# Altium schematic sheet 3_p2_power.schdoc
size 307 x 218 mm; Symbol: Sheet-Symbol_A4; Device: Sheet-Symbol_A4; @Project Name: ai_camera; @Page Count: 5; @Update Date: 2026-03-19; @Create Date: 2026-03-11; @Schematic Name: Schematic1; @Page No: 3; @Page Name: p2_power; @Board Name: Board1; Company: 嘉立创EDA; Version: V1.0; Page Size: A4; Convert to PCB: yes; Add into BOM: yes; Title Block Position: 3; Width: 1170; Height: 825; Region Start: 1; X Region Count: 6; Y Region Count: 4; Blade Width: 10; @Create Time: 00:25:12; @Update Time: 15:53:27
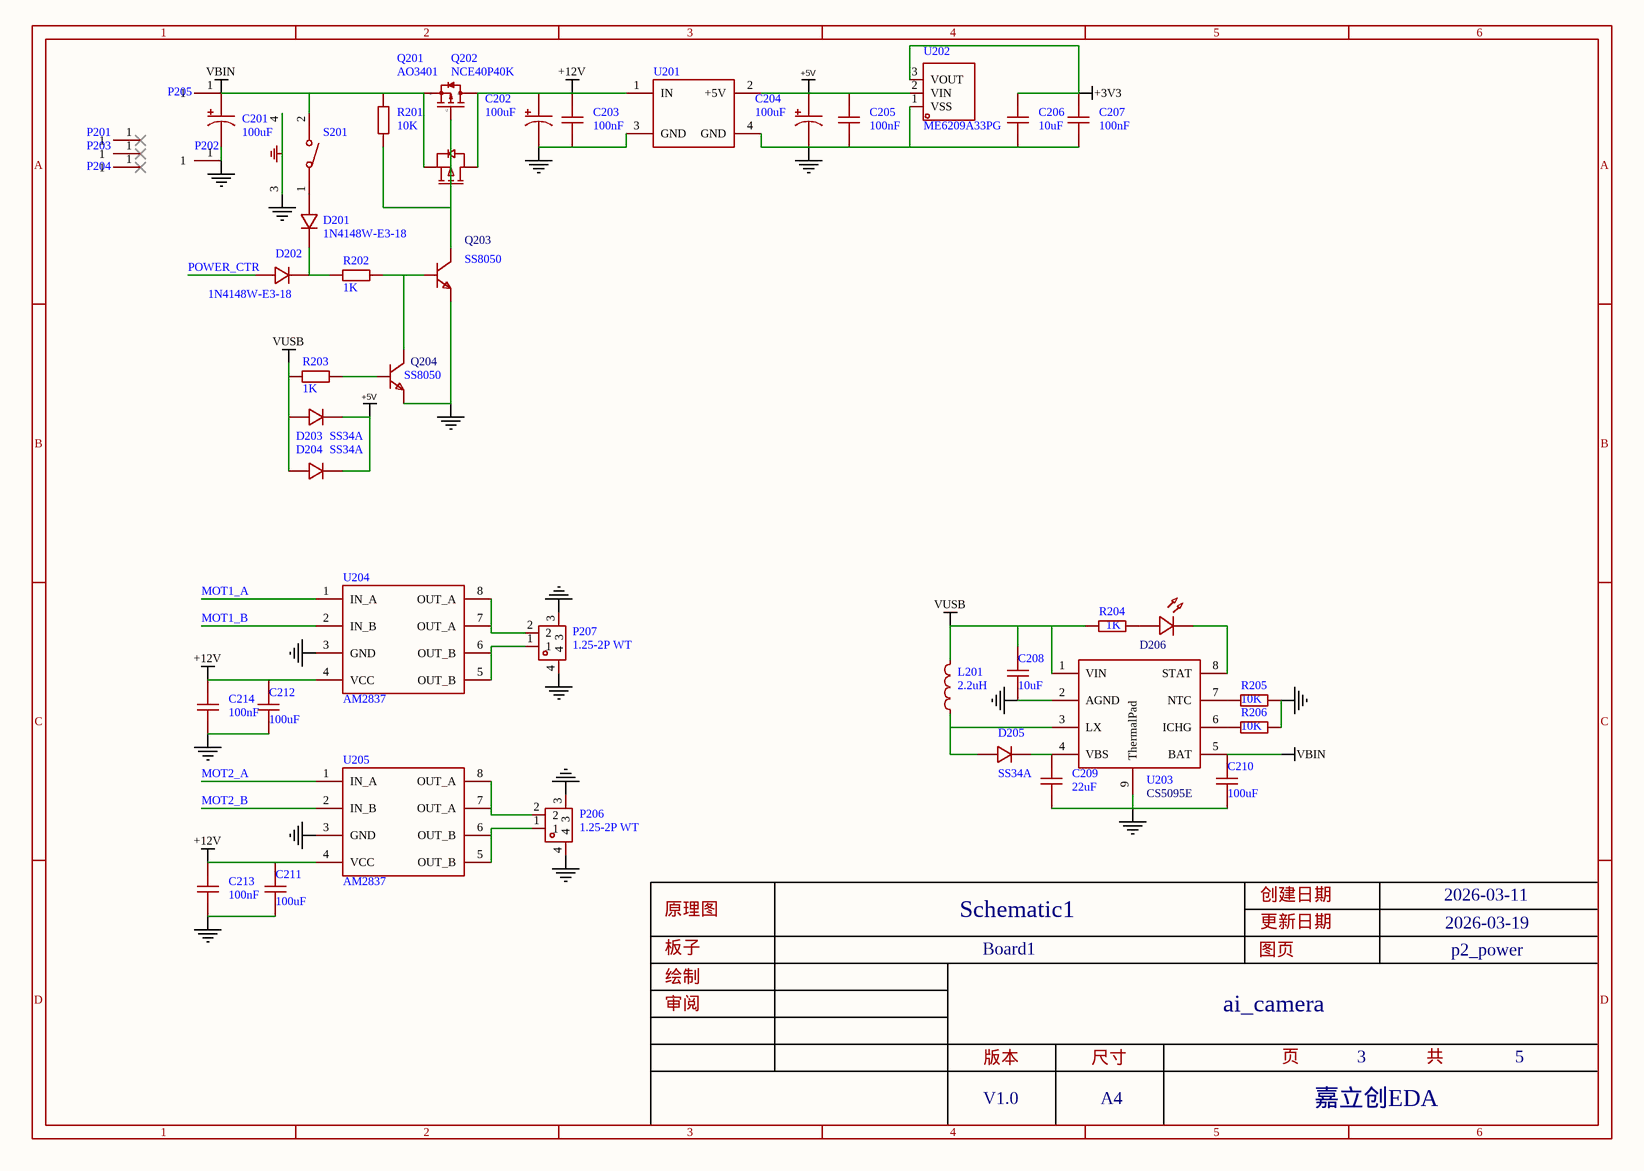
[diagram p0: 3_p2_power.schdoc]

## Parts
C201  100uF  [CAP-SMD_BD6.3-L6.6-W6.6-LS7.2-R-RD]
C202  100uF  [CAP-SMD_BD6.3-L6.6-W6.6-LS7.2-R-RD]
C203  100nF  [C0603]
C204  100uF  [CAP-SMD_BD6.3-L6.6-W6.6-LS7.2-R-RD]
C205  100nF  [C0603]
C206  10uF  [C0603]
C207  100nF  [C0603]
C208  10uF  [C0805]
C209  22uF  [C0805]
C210  100uF  [C0805]
C211  100uF  [C0805]
C212  100uF  [C0805]
C213  100nF  [C0603]
C214  100nF  [C0603]
D201  1N4148W-E3-18  [SOD-123_L2.7-W1.6-LS3.7-FD]
D202  1N4148W-E3-18  [SOD-123_L2.7-W1.6-LS3.7-FD]
D203  SS34A  [SMA_L4.3-W2.6-LS5.2-RD]
D204  SS34A  [SMA_L4.3-W2.6-LS5.2-RD]
D205  SS34A  [SMA_L4.3-W2.6-LS5.2-RD]
D206  (no value)  [LED_0603]
L201  2.2uH  [IND-SMD_L5.8-W5.2]
P201  (no value)  [Single_Pin]
P202  (no value)  [Single_Pin]
P203  (no value)  [Single_Pin]
P204  (no value)  [Single_Pin]
P205  (no value)  [Single_Pin]
P206  1.25-2P WT  [CONN-SMD_1.25-2PWT]
P207  1.25-2P WT  [CONN-SMD_1.25-2PWT]
Q201  AO3401  [SOT-23-3_L2.9-W1.3-P1.90-LS2.4-BR]
Q202  NCE40P40K  [TO-252-2_L6.6-W6.1-P4.57-LS9.9-TL-CW]
Q203  SS8050  [SOT-23-3_L2.9-W1.3-P1.90-LS2.4-BR]
Q204  SS8050  [SOT-23-3_L2.9-W1.3-P1.90-LS2.4-BR]
R201  10K  [R0603]
R202  1K  [R0603]
R203  1K  [R0603]
R204  1K  [R0603]
R205  10K  [R0603]
R206  10K  [R0603]
S201  TC-1102N-C-A-B  [SW-TH_TC-1102N-C-A-B]  (value not drawn)
U201  (no value)  [CX8823_MO]
U202  ME6209A33PG  [SOT-89-3_L4.5-W2.5-P1.50-LS4.2-BR]
U203  (no value)  [ESOP-8_L4.9-W3.9-P1.27-LS6.0-BL-EP]
U204  AM2837  [sop-8_l5.0-w4.0-p1.27-ls6.2-bl]
U205  AM2837  [sop-8_l5.0-w4.0-p1.27-ls6.2-bl]

## Nets
+3V3: C206.2 C207.2 U202.3(VOUT)
+5V: C204.1 C205.2 D203.1(C) D204.1(C) U201.2(+5V) U202.2(VIN)
+12V: C202.1 C203.2 C211.1 C212.1 C213.2 C214.2 Q201.3(D) Q202.2(D) U201.1(IN) U204.4(VCC) U205.4(VCC)
GND: C201.2 C202.2 C203.1 C204.2 C205.1 C206.1 C207.1 C208.2 C209.2 C210.2 C211.2 C212.2 C213.1 C214.1 P202.1 P206.3 P206.4 P207.3 P207.4 Q203.2(E) Q204.2(E) R205.1 R206.1 S201.3 S201.4 U201.3(GND) U201.4(GND) U202.1(VSS) U203.2(AGND) U203.9(ThermalPad) U204.3(GND) U205.3(GND)
VBIN: C201.1 C210.1 P205.1 Q201.2(S) Q202.3(S) R201.2 S201.2 U203.5(BAT)
VUSB: C208.1 D203.2(A) D204.2(A) L201.2 R203.2 R204.2 U203.1(VIN)
MOT1_A: U204.1(IN_A)
MOT1_B: U204.2(IN_B)
MOT2_A: U205.1(IN_A)
MOT2_B: U205.2(IN_B)
POWER_CTR: D202.1(A)
NetC209_1: C209.1 D205.1(C) U203.4(VBS)
NetD201_1: D201.1(A) S201.1
NetD201_2: D201.2(K) D202.2(K) R202.2
NetD205_2: D205.2(A) L201.1 U203.3(LX)
NetD206_1: D206.1(C) U203.8(STAT)
NetD206_2: D206.2(A) R204.1
NetP206_1: P206.1 U205.5(OUT_B) U205.6(OUT_B)
NetP206_2: P206.2 U205.7(OUT_A) U205.8(OUT_A)
NetP207_1: P207.1 U204.5(OUT_B) U204.6(OUT_B)
NetP207_2: P207.2 U204.7(OUT_A) U204.8(OUT_A)
NetQ201_1: Q201.1(G) Q202.1(G) Q203.3(C) R201.1
NetQ203_1: Q203.1(B) Q204.3(C) R202.1
NetQ204_1: Q204.1(B) R203.1
NetR205_2: R205.2 U203.7(NTC)
NetR206_2: R206.2 U203.6(ICHG)

Not connected (* = marked no-connect by the designer): P201 1*; P203 1*; P204 1*

## Notes on the sheet
- 1
- 2
- 3
- 4
- 5
- 6
- A
- B
- C
- 原理图
- Schematic1
- 创建日期
- 更新日期
- 2026-03-11
- 2026-03-19
- 绘制
- 板子
- Board1
- 图页
- p2_power
- D
- 审阅
- 版本
- 尺寸
- ai_camera
- 页
- 共
- V1.0
- A4
- 嘉立创EDA

## Library data of the parts
C201 C202 C204 = VEJ101M1CTR-0605: Manufacturer: lelon(立隆); Add into BOM: yes; Tolerance: ±20%; Rated Voltage: 16V; φD: 6.3mm; L: 5.3mm; Lifetime @ Temp: 2000hrs@105℃; Symbol: VEJ101M1CTR-0605; Device: VEJ101M1CTR-0605; LCSC Part Name: 100uF ±20% 16V; Supplier Part: C164064; Manufacturer Part: VEJ101M1CTR-0605; Supplier Footprint: SMD,6.3x5.3mm; JLCPCB Part Class: Extended Part; Datasheet: https://atta.szlcsc.com/upload/public/pdf/source/20180126/C164064_15169515392981308320.pdf; Supplier: LCSC; Convert to PCB: yes; Value: 100uF; Ripple Current: -; Equivalent Series Resistance(ESR): -; Operating Temperature: -45℃~+105℃
C203 C205-C214 = CAP_0603: Symbol: CapAcitance; Convert to PCB: yes; Device: CAP_0603; Add into BOM: yes; Supplier Footprint: 0603
  C203 C205 C207 C213 C214: Value: 100nF
  C206 C208: Value: 10uF
  C209: Value: 22uF
  C210-C212: Value: 100uF
D201 D202 = 1N4148W-E3-18: Manufacturer: VISHAY(威世); Add into BOM: yes; Power Dissipation: 350mW; Reverse Voltage (Vr): 100V; Average Rectified Current (Io): 150mA; Forward Voltage (Vf@If): 1.2V@100mA; Reverse Leakage Current: 100μA@100V; Reverse Recovery Time (trr): 4ns; Symbol: 1N4148W-E3-18; Device: 1N4148W-E3-18; LCSC Part Name: 100V 150mA 4ns; Supplier Part: C191428; Manufacturer Part: 1N4148W-E3-18; Supplier Footprint: SOD-123; JLCPCB Part Class: Extended Part; Datasheet: https://atta.szlcsc.com/upload/public/pdf/source/20180503/C191428_AD0ED457CC768099CBC92C1868282AFA.pdf; Supplier: LCSC; Convert to PCB: yes; Diode Configuration: -; Operating Temperature: +150℃@(Tj)
D203-D205 = SS34A_C211775: Manufacturer: YANGJIE(扬杰); Add into BOM: yes; Reverse Voltage (Vr): 40V; Average Rectified Current (Io): 3A; Forward Voltage (Vf@If): 500mV@3A; Symbol: SS34A; Device: SS34A_C211775; LCSC Part Name: 40V 3A 500mV@3A; Supplier Part: C211775; Manufacturer Part: SS34A; Supplier Footprint: SMA; JLCPCB Part Class: Extended Part; Datasheet: https://atta.szlcsc.com/upload/public/pdf/source/20190516/C211775_5CF5F6A2E43CD0CA4A389CCA8A88582C.pdf; Supplier: LCSC; Convert to PCB: yes
D206 = LED_0603-R: Symbol: LED_R; Convert to PCB: yes; Device: LED_0603-R; Add into BOM: yes; Supplier Footprint: 0603
L201 = SCCD54-4R7MT: Manufacturer: Yanchuang(研创); Add into BOM: yes; Value: 4.7uH; Tolerance: ±20%; Rated Current: 2.5A; DC Resistance (DCR): 38mΩ; Symbol: SCCD54-4R7MT; Device: SCCD54-4R7MT; LCSC Part Name: 4.7uH ±20% 2.5A 38mΩ; Supplier Part: C532870; Manufacturer Part: SCCD54-4R7MT; Supplier Footprint: SMD; JLCPCB Part Class: Extended Part; Datasheet: https://atta.szlcsc.com/upload/public/pdf/source/20200515/C532850_02BFFFF91E0F9B1D12EE1A1A1220C654.pdf; Supplier: LCSC; Convert to PCB: yes
P201-P205 = Single_Pin: Add into BOM: yes; Symbol: Single_Pin; Device: Single_Pin; Convert to PCB: yes
P206 P207 = 1.25-2P WT: Manufacturer: SHOU HAN(首韩); Add into BOM: yes; Pitch: 1.25mm; Pins Structure: 1x2P; Number of PINs Per Row: 2; Gender: 公型插针; Current Rating (Max): 1A; Symbol: 1.25-2P WT; Device: 1.25-2P WT; LCSC Part Name: 1.25卧贴针座 1.25mm间距2P卧式贴片 WT指的是卧贴; Supplier Part: C668614; Manufacturer Part: 1.25-2P WT; Supplier Footprint: SMD,P=1.25mm; JLCPCB Part Class: Extended Part; Datasheet: https://atta.szlcsc.com/upload/public/pdf/source/20200618/C668614_A66416DD0743C4A51377B45DB73E146E.pdf; Supplier: LCSC; Convert to PCB: yes; Reference Series: -; Number of Rows: 1; Row Spacing: -; Mounting Style: 卧贴; Operating Temperature Range: -25℃~+85℃
Q201 = AO3401_C181091: Manufacturer: Hottech(合科泰); Add into BOM: yes; Type: P沟道; Drain Source Voltage (Vdss): 30V; Continuous Drain Current (Id): 4.2A; Power Dissipation (Pd): 350mW; Drain Source On Resistance (RDS(on)@Vgs,Id): 65mΩ@10V,4.2A; Gate Threshold Voltage (Vgs(th)@Id): 1.3V@250μA; Symbol: AO3401; Device: AO3401_C181091; LCSC Part Name: P沟道 30V 4.2A; Supplier Part: C181091; Manufacturer Part: AO3401; Supplier Footprint: SOT-23(SOT-23-3); JLCPCB Part Class: Extended Part; Datasheet: https://atta.szlcsc.com/upload/public/pdf/source/20180131/C181091_15173931948391329220.pdf; Supplier: LCSC; Convert to PCB: yes
Q202 = NCE40P40K: Manufacturer: 无锡新洁能; Add into BOM: yes; Type: P沟道; Drain Source Voltage (Vdss): 40V; Continuous Drain Current (Id): 40A; Power Dissipation (Pd): 80W; Drain Source On Resistance (RDS(on)@Vgs,Id): 14mΩ@10V,12A; Gate Threshold Voltage (Vgs(th)@Id): 3V@250μA; Symbol: NCE40P40K; Device: NCE40P40K; LCSC Part Name: P沟道 40V 40A; Supplier Part: C130100; Manufacturer Part: NCE40P40K; Supplier Footprint: TO-252-2(DPAK); JLCPCB Part Class: Extended Part; Datasheet: https://atta.szlcsc.com/upload/public/pdf/source/20170919/C130100_1505787178459976873.pdf; Supplier: LCSC; Convert to PCB: yes
Q203 Q204 = SS8050: Manufacturer: CJ（江苏长电/长晶）; Symbol: SS8050_C2150; Add into BOM: yes; Transistor Type: NPN; Collector-Emitter Breakdown Voltage (Vceo): 25V; Collector Current (Ic): 1.5A; Power Dissipation (Pd): 300mW; Collector-Emitter Saturation Voltage (VCE(sat)@Ic,Ib): 500mV@800mA,80mA; DC Current Gain (hFE@Ic,Vce): 200@100mA,1V; Transition Frequency (fT): 100MHz; Device: SS8050; LCSC Part Name: SS8050 Y1 200-350 Y1 200-350; Supplier Part: C2150; Manufacturer Part: SS8050; Supplier Footprint: SOT-23(SOT-23-3); JLCPCB Part Class: Basic Part; Datasheet: https://atta.szlcsc.com/upload/public/pdf/source/20140809/1457707209319.pdf; Supplier: LCSC; Convert to PCB: yes; Operating Temperature: +150℃@(Tj)
R201-R206 = Res_0603: Symbol: 电阻; Convert to PCB: yes; Device: Res_0603; Add into BOM: yes; Supplier Footprint: 0603
  R201 R205 R206: Value: 10K
  R202-R204: Value: 1K
S201 = TC-1102N-C-A-B: Manufacturer: XKB Connectivity(中国星坤); Add into BOM: yes; Contact Current: 50mA; Voltage Rating (DC): 12V; Insulation Resistance: 100mΩ; Circuit: 单刀单掷; Actuator Style: 圆形按钮; Actuator/Cap Color: 黑色; With Lamp: 无; Operating Force: 260gf; Mechanical Life: 300000; Pin Style: PC引脚; Switch Length: 6mm; Switch Height: 5mm; Strike Gundam: 是; Symbol: TC-1102N-C-A-B; Device: TC-1102N-C-A-B; LCSC Part Name: 6*6*5.0带支架 侧边按键 力度260gf 高寿命; Supplier Part: C406152; Manufacturer Part: TC-1102N-C-A-B; Supplier Footprint: 插件; JLCPCB Part Class: Extended Part; Datasheet: https://atta.szlcsc.com/upload/public/pdf/source/20211011/8943A334D21548136505FDDC6F7285B9.pdf; Supplier: LCSC; Convert to PCB: yes; Mounting Style: 卧插; Operating Temperature: -30℃~+85℃; Switch Width: 6mm
U201 = CX8823_5V: Add into BOM: yes; Symbol: CX8823_5V; Device: CX8823_5V; Convert to PCB: yes
U202 = ME6209A33PG: Manufacturer: MICRONE(南京微盟); Add into BOM: yes; Output Type: 固定; Output Polarity: 正; Number of Outputs: 1; Maximum Input Voltage: 18V; Output Voltage: 3.3V; Dropout Voltage: 80mV@(40mA); Output Current: 250mA; Symbol: ME6209A33PG; Device: ME6209A33PG; LCSC Part Name: Vin=18V Vout=3.3V 250mA; Supplier Part: C80222; Manufacturer Part: ME6209A33PG; Supplier Footprint: SOT-89(SOT-89-3); JLCPCB Part Class: Extended Part; Datasheet: https://atta.szlcsc.com/upload/public/pdf/source/20160903/1472896599532.pdf; Supplier: LCSC; Convert to PCB: yes; Power Supply Rejection Ratio (PRSS): -
U203 = CS5095E: Add into BOM: yes; Symbol: CS5095E; Device: CS5095E; Convert to PCB: yes
U204 U205 = AM2837: Add into BOM: yes; Symbol: AM2837; Device: AM2837; Convert to PCB: yes